# EAGLE board esp32-kitchensink (EAGLE 9.6.2)
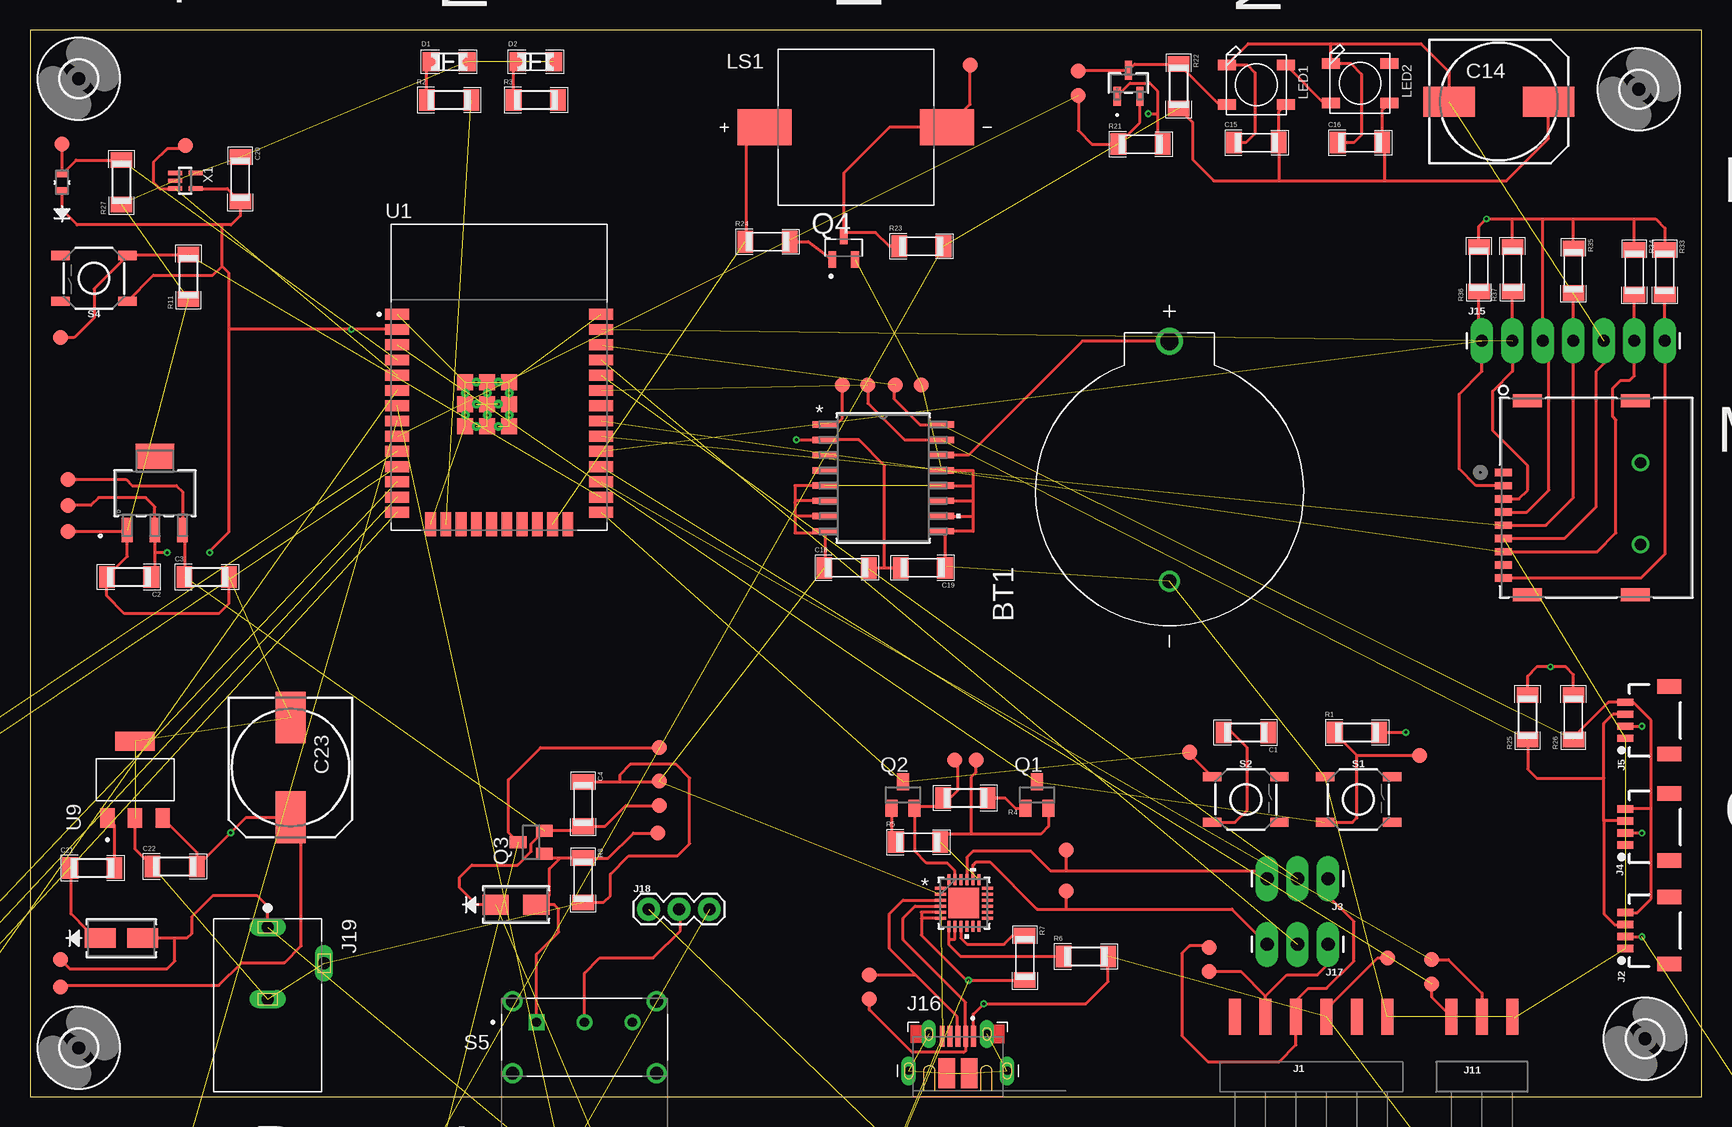
[diagram p8: board, top side]
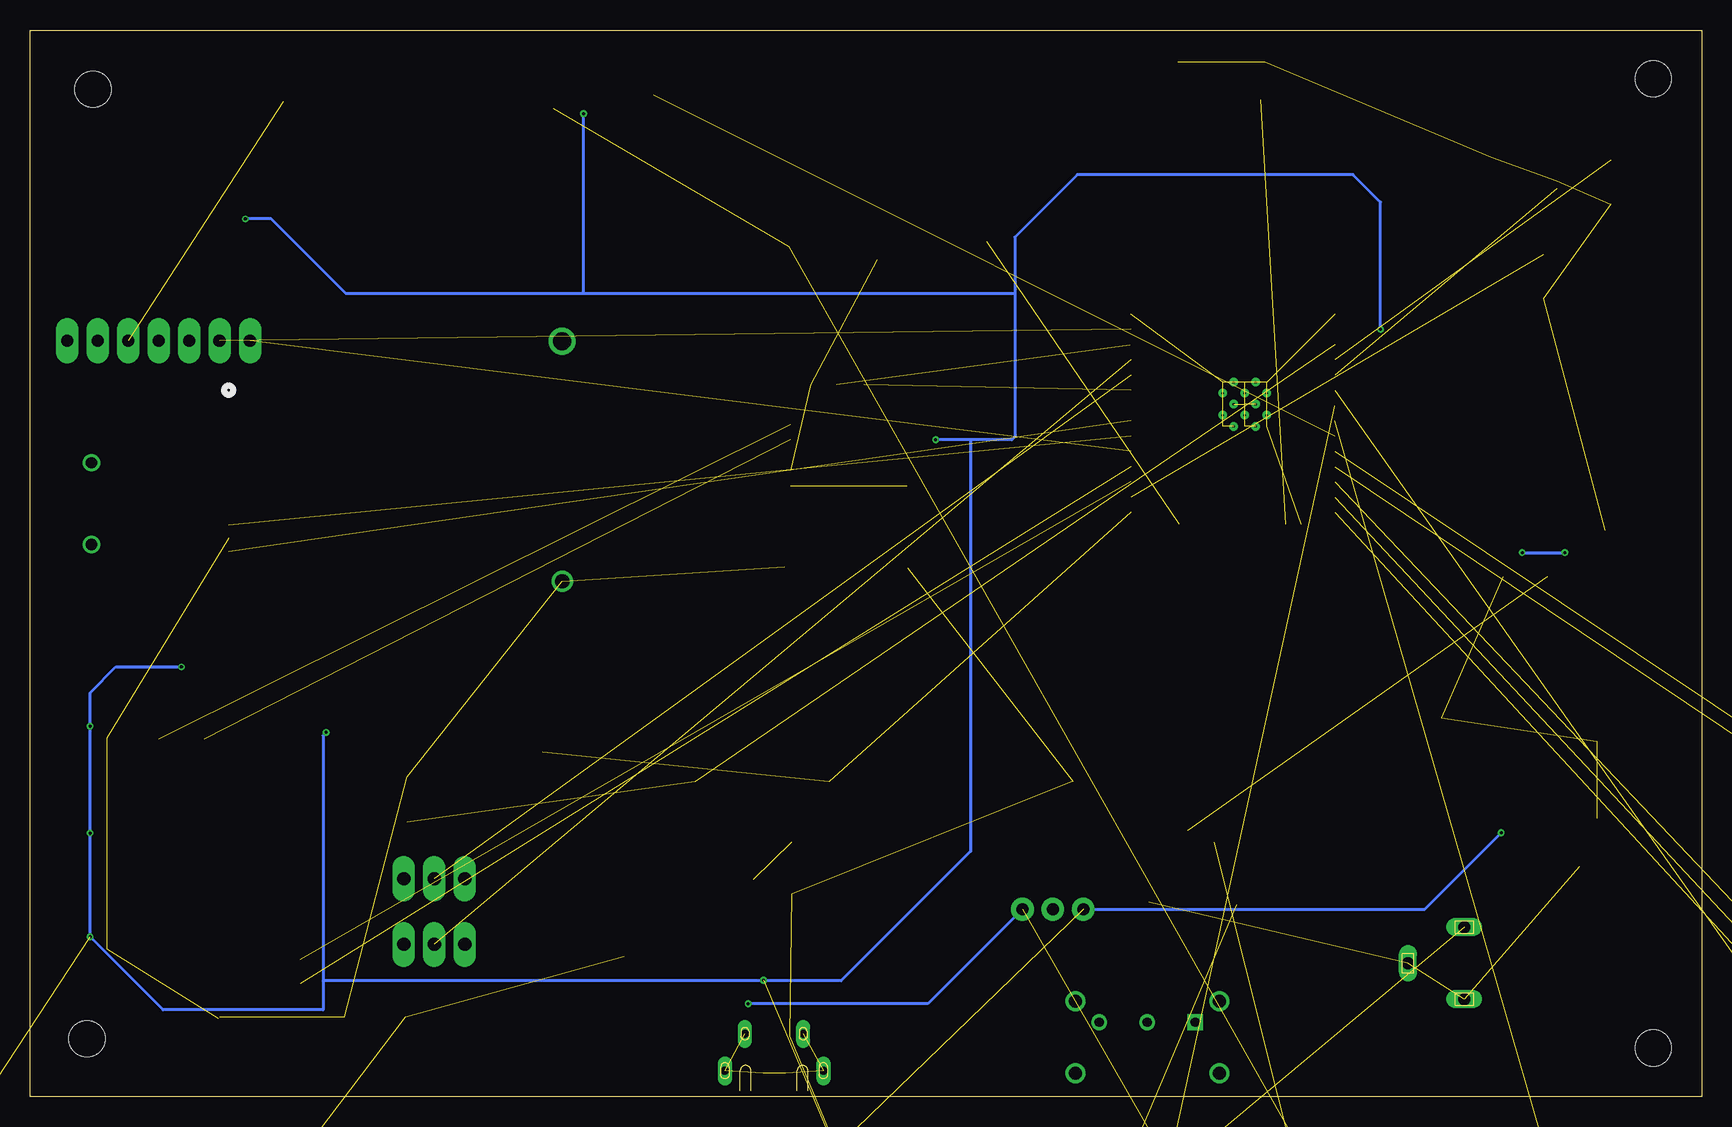
[diagram p9: board, bottom side, seen from below]

Size 139.37 x 88.89 mm. Coordinates in mm from the lower left corner, seen from the top.
Outline: 0,0 139.37,0 139.37,88.89 0,88.89 0,0
Copper layers (1*16): Top 0.035mm / dielectric 1.5mm / Bottom 0.035mm
Design rules "design_rule_check": minimum track width 6mil, minimum drill 10mil, track to track 6mil, track to pad 6mil, pad to pad 6mil, via to via 6mil, smd to smd 6mil, copper to edge 20mil, drill to drill 10mil, minimum pad ring 10mil, minimum via ring 6mil, stop-mask expansion 4mil, vias tented up to drill 0mil, thermal gap 10mil

## Footprints (pad centres in the part's own frame; a part is rotated, then mirrored left to right if it is on the bottom)
BAT_BS-7 = drill 1.5: + 10,0 | drill 1.17: - -10,0
1206 = smd 1.3 x 1.8: 1 -1.85,0; 2 1.85,0
140CLH-1010 = smd 4.3 x 2.5: + 4.15,0; - -4.15,0
JST-PH-2-THM-RA = drill 0.8 pad 1.422: 1 1,0; 2 -1,0
1206.LED = smd 1.4 x 1.6: P$1 -1.5,0; P$2 1.5,0
DIODE_DO214AC = smd 2.184 x 1.651: 1 -1.702,0; 2 1.702,0
SMA_DIO-M = smd 2.561 x 1.63: 1 -1.768,0; 2 1.768,0
3,0 = hole 3: 0,0
1X06-SMD_RA_MALE_NO_HOLES = smd 1 x 3: 1 -6.35,5; 2 -3.81,5; 3 -1.27,5; 4 1.27,5; 5 3.81,5; 6 6.35,5
1X04_1MM_RA = smd 0.6 x 1.35: 1 -1.5,0; 2 -0.5,0; 3 0.5,0; 4 1.5,0 | smd 1.2 x 2: NC1 2.8,-3.675; NC2 -2.8,-3.675
1X03_LONGPADS = drill 1.118 pad 1.88 long: 1 0,0; 2 2.54,0; 3 5.08,0
1X02_2.54_SCREWTERM = drill 1.016 square: P1 2.54,0; P2 0,0
1X02 = drill 1.016 pad 1.88: 1 0,0; 2 2.54,0
1X03 = drill 1.016 pad 1.88: 1 0,0; 2 2.54,0; 3 5.08,0
SCREWTERMINAL-5MM-2 = drill 1.3 pad 2.032 square: 1 0,0 | drill 1.3 pad 2.032: 2 5,0
1X03_SMD_RA_MALE = smd 1 x 3: 1 -2.54,5; 2 0,5; 3 2.54,5
1X02_LOCK_LONGPADS = drill 1.016 long: 1 -0.127,0; 2 2.667,0
MEM2075-00-140-01-A_GCT = smd 1.092 x 2.388: 10 -8.075,5.745; 11 8.075,5.745; 12 -8.075,-3.255; 13 8.075,-3.255 | drill 0.94 pad 1.448: 14 -3.886,-3.683; 15 2.921,-3.683 | smd 0.61 x 1.397: P1 2.105,7.745; P2 1.005,7.745; P3 -0.095,7.745; P4 -1.195,7.745; P5 -2.295,7.745; P6 -3.395,7.745; P7 -4.495,7.745; P8 -5.595,7.745; P9 -6.695,7.745
1X07_LONGPADS = drill 1.016 pad 1.88 long: 1 0,0; 2 2.54,0; 3 5.08,0; 4 7.62,0; 5 10.16,0; 6 12.7,0; 7 15.24,0
AMPHENOL_10103592-0001LF = smd 0.4 x 1.75: 1 1.3,2.875; 2 0.65,2.875; 3 0,2.875; 4 -0.65,2.875; 5 -1.3,2.875 | drill 0.65 pad 0.8 long: P1 -2.425,3.08; P2 2.425,3.08 | drill 0.7 pad 1.05 long: P3 -4.1,0; P6 4.1,0 | smd 1.375 x 2.5: P4 -0.938,-0.2; P5 0.938,-0.2
CUI_PJ-102AH = drill 1 long: 1 -6.5,0; 2 -0.5,0; 3 -3.5,4.7
IND_TAIYO_NRH2410_TAY = smd 0.699 x 2.007: 1 -0.73,0; 2 0.73,0
IND_NRS5024_TAY = smd 1.499 x 3.988: 1 -1.8,0; 2 1.8,0
WS2812B = smd 1.5 x 0.9: 1-VDD 2.45,-1.65; 2-DOUT 2.45,1.65; 3-GND -2.45,1.65; 4-DIN -2.45,-1.65
LED_77/TR8_EVE = smd 0.552 x 0.889: 1 -0.676,0; 2 0.676,0
XDCR_SMT-1341-T-HT-R = smd 4.5 x 3: N 7.6,0; P -7.6,0
SOT23 = smd 1 x 1.4: 1 -0.95,-1.1; 2 0.95,-1.1; 3 0,1.1
PN2222A-SOT-23 = smd 0.635 x 1.397: BASE -0.95,-0.98; COLLECTOR 0,0.98; EMITTER 0.95,-0.98
SOIC127P600X175-8N = smd 1.525 x 0.7: 1 -2.712,1.905; 2 -2.712,0.635; 3 -2.712,-0.635; 4 -2.712,-1.905; 5 2.712,-1.905; 6 2.712,-0.635; 7 2.712,0.635; 8 2.712,1.905
RESC6331X80N = smd 2.44 x 3.32: 1 -2.39,0; 2 2.39,0
TACTILE_SWITCH_SMD_5.2MM = smd 1.524 x 0.762: 1 -2.794,1.905; 2 2.794,1.905; 3 -2.794,-1.905; 4 2.794,-1.905
SW_EG1224 = drill 0.79 square: 1 -4,1.25 | drill 0.79: 2 0,1.25; 3 4,1.25 | drill 1.09: S1 -6,-3; S2 6,-3; S3 6,3; S4 -6,3
TP = smd 3.81 x 5.08: P$1 0,0
PAD.03X.05 = smd 1.27 x 1.27: P$1 0,0
MODULE_ESP32-WROOM-32D = smd 2 x 0.9: 1 -8.5,5.26; 2 -8.5,3.99; 3 -8.5,2.72; 4 -8.5,1.45; 5 -8.5,0.18; 6 -8.5,-1.09; 7 -8.5,-2.36; 8 -8.5,-3.63; 9 -8.5,-4.9; 10 -8.5,-6.17; 11 -8.5,-7.44; 12 -8.5,-8.71; 13 -8.5,-9.98; 14 -8.5,-11.25; 25 8.5,-11.25; 26 8.5,-9.98; 27 8.5,-8.71; 28 8.5,-7.44; 29 8.5,-6.17; 30 8.5,-4.9; 31 8.5,-3.63; 32 8.5,-2.36; 33 8.5,-1.09; 34 8.5,0.18; 35 8.5,1.45; 36 8.5,2.72; 37 8.5,3.99; 38 8.5,5.26 | smd 0.9 x 2: 15 -5.715,-12.25; 16 -4.445,-12.25; 17 -3.175,-12.25; 18 -1.905,-12.25; 19 -0.635,-12.25; 20 0.635,-12.25; 21 1.905,-12.25; 22 3.175,-12.25; 23 4.445,-12.25; 24 5.715,-12.25 | smd 1.33 x 1.33: 39_1 -2.835,-0.405; 39_2 -1,-0.405; 39_3 0.835,-0.405; 39_4 -2.835,-2.24; 39_5 -1,-2.24; 39_6 0.835,-2.24; 39_7 -2.835,-4.075; 39_8 -1,-4.075; 39_9 0.835,-4.075 | drill 0.2 pad 0.3: 39_10 -1.917,-0.405; 39_11 -0.083,-0.405; 39_12 -2.835,-1.323; 39_13 -1,-1.323; 39_14 0.835,-1.323; 39_15 -1.917,-2.24; 39_16 -0.083,-2.24; 39_17 -2.835,-3.158; 39_18 -1,-3.158; 39_19 0.835,-3.158; 39_20 -1.917,-4.075; 39_21 -0.083,-4.075
SOT-223_DIO-M = smd 0.902 x 2.066: 1 -2.3,-3.076; 2 0,-3.076; 3 2.3,-3.076 | smd 3.202 x 2.066: 4 0,3.076
QFN24_CP2102N_SIL-M = smd 0.914 x 0.254: 1 -1.943,1.25; 2 -1.943,0.75; 3 -1.943,0.25; 4 -1.943,-0.25; 5 -1.943,-0.75; 6 -1.943,-1.25; 13 1.943,-1.25; 14 1.943,-0.75; 15 1.943,-0.25; 16 1.943,0.25; 17 1.943,0.75; 18 1.943,1.25 | smd 0.254 x 0.914: 7 -1.25,-1.943; 8 -0.75,-1.943; 9 -0.25,-1.943; 10 0.25,-1.943; 11 0.75,-1.943; 12 1.25,-1.943; 19 1.25,1.943; 20 0.75,1.943; 21 0.25,1.943; 22 -0.25,1.943; 23 -0.75,1.943; 24 -1.25,1.943 | smd 2.54 x 2.54: 25 0,0
SOT-23-5_MC_MCH-M = smd 1.626 x 0.508: 1 -1.346,0.95; 2 -1.346,0; 3 -1.346,-0.95; 4 1.346,-0.95; 5 1.346,0.95
DBV0005A_M = smd 1.2 x 0.65: 1 -1.475,0.95; 2 -1.475,0; 3 -1.475,-0.95; 4 1.475,-0.95; 5 1.475,0.95
MSOP8_DIO = smd 1.041 x 0.381: 1 -2.121,0.975; 2 -2.121,0.325; 3 -2.121,-0.325; 4 -2.121,-0.975; 5 2.121,-0.975; 6 2.121,-0.325; 7 2.121,0.325; 8 2.121,0.975
SOIC8_ZXBM5210-SP-13_DIO-M = smd 1.653 x 0.559: 1 -2.782,1.905; 2 -2.782,0.635; 3 -2.782,-0.635; 4 -2.782,-1.905; 5 2.782,-1.905; 6 2.782,-0.635; 7 2.782,0.635; 8 2.782,1.905
SOT-23_3L_ONS-M = smd 0.61 x 1.575: 1 -0.953,-1.092; 2 0.953,-1.092; 3 0,1.092
VREG_TS2940CW50_RPG = smd 1.6 x 1.2: 1 -3.2,2.3; 2 -3.2,0; 3 -3.2,-2.3 | smd 1.6 x 3.3: 4 3.2,0
SC59_DIO-M = smd 0.482 x 1.416: 1 -1.2,-1.251; 2 0,1.251; 3 1.2,-1.251
21-0042B_16_MXM-M = smd 2.083 x 0.533: 1 -4.839,4.445; 2 -4.839,3.175; 3 -4.839,1.905; 4 -4.839,0.635; 5 -4.839,-0.635; 6 -4.839,-1.905; 7 -4.839,-3.175; 8 -4.839,-4.445; 9 4.839,-4.445; 10 4.839,-3.175; 11 4.839,-1.905; 12 4.839,-0.635; 13 4.839,0.635; 14 4.839,1.905; 15 4.839,3.175; 16 4.839,4.445
SOIC-16_ONS-M = smd 1.702 x 0.533: 1 -2.807,4.445; 2 -2.807,3.175; 3 -2.807,1.905; 4 -2.807,0.635; 5 -2.807,-0.635; 6 -2.807,-1.905; 7 -2.807,-3.175; 8 -2.807,-4.445; 9 2.807,-4.445; 10 2.807,-3.175; 11 2.807,-1.905; 12 2.807,-0.635; 13 2.807,0.635; 14 2.807,1.905; 15 2.807,3.175; 16 2.807,4.445
SC70-5 = smd 0.35 x 1.15: 1 -0.65,-0.85; 2 0,-0.85; 3 0.65,-0.85; 4 0.65,0.85; 5 -0.65,0.85

## Placement (x,y rotation side)
BT1  BS-7  [BAT_BS-7]  95,52.96 90 top
C1  0.1 uF  [1206]  101.35,30.35 180 top
C2  1 uF  [1206]  8.26,43.31 180 top
C3  1 uF  [1206]  14.73,43.31 0 top
C4  1.0 uF  [1206]  46.1,24.38 270 top
C5  4.7 uF  [1206]  -36.83,-121.92 0 top  (outside the outline)
C6  4.7 uF  [1206]  -30.48,-121.92 0 top  (outside the outline)
C7  22 uF  [1206]  119.38,-128.27 0 top  (outside the outline)
C8  120 pF  [1206]  125.73,-128.27 0 top  (outside the outline)
C9  10 uF  [1206]  2.54,-119.38 0 top  (outside the outline)
C10  22 uF  [1206]  8.89,-119.38 0 top  (outside the outline)
C11  22 uF  [1206]  15.24,-119.38 0 top  (outside the outline)
C12  1 uF  [1206]  -154.94,-54.61 0 top  (outside the outline)
C13  10 uF  [1206]  -148.59,-54.61 0 top  (outside the outline)
C14  1000 uF  [140CLH-1010]  122.43,82.93 0 top
C15  0.1 uF  [1206]  102.23,79.5 0 top
C16  0.1 uF  [1206]  110.87,79.5 0 top
C17  0.1 uF  [1206]  49.53,-55.88 0 top  (outside the outline)
C18  0.1 uF  [1206]  68.07,44.07 0 top
C19  10 uF  [1206]  74.42,44.07 180 top
C20  1 uF  [1206]  17.53,76.45 270 top
C21  0.47 uF  [1206]  5.21,19.05 0 top
C22  22 uF  [1206]  12.06,19.18 0 top
C23  1000 uF  [140CLH-1010]  21.72,27.43 270 top
CN2  [JST-PH-2-THM-RA]  -43.18,-120.65 0 top  (outside the outline)
D1  [1206.LED]  34.92,86.23 0 top
D2  [1206.LED]  42.16,86.23 0 top
D3  [1206.LED]  -44.45,-113.03 0 top  (outside the outline)
D4  SS14-E3/5AT  [DIODE_DO214AC]  40.51,16 0 top
D5  SS14-E3/5AT  [DIODE_DO214AC]  102.87,-133.35 0 top  (outside the outline)
D6  [1206.LED]  -76.2,-57.15 0 top  (outside the outline)
D7  [1206.LED]  -69.85,-57.15 0 top  (outside the outline)
D8  [1206.LED]  -63.5,-57.15 0 top  (outside the outline)
D9  [1206.LED]  -57.15,-57.15 0 top  (outside the outline)
D10  [1206.LED]  -90.17,-52.07 0 top  (outside the outline)
D11  [1206.LED]  -83.82,-52.07 0 top  (outside the outline)
D12  [1206.LED]  -77.47,-52.07 0 top  (outside the outline)
D13  [1206.LED]  -71.12,-52.07 0 top  (outside the outline)
D14  RS1BB-13-FSMA_DIO-M  [SMA_DIO-M]  7.62,13.21 0 top
H1  MOUNT-HOLE3.0  [3,0]  134.11,83.95 0 top
H2  MOUNT-HOLE3.0  [3,0]  134.62,4.83 0 top
H3  MOUNT-HOLE3.0  [3,0]  4.06,84.84 0 top
H4  MOUNT-HOLE3.0  [3,0]  4.06,4.06 0 top
J1  [1X06-SMD_RA_MALE_NO_HOLES]  106.81,1.65 0 top
J2  [1X04_1MM_RA]  132.97,13.84 90 top
J3  [1X03_LONGPADS]  108.2,18.16 180 top
J4  [1X04_1MM_RA]  132.97,22.48 90 top
J5  [1X04_1MM_RA]  132.97,31.37 90 top
J6  [1X02_2.54_SCREWTERM]  -162.56,-53.34 0 top  (outside the outline)
J7  [1X02]  -143.51,-54.61 0 top  (outside the outline)
J8  [1X03]  60.96,-113.03 0 top  (outside the outline)
J9  [SCREWTERMINAL-5MM-2]  -8.89,-80.01 0 top  (outside the outline)
J10  [SCREWTERMINAL-5MM-2]  -8.89,-71.12 0 top  (outside the outline)
J11  [1X03_SMD_RA_MALE]  121.03,1.65 0 top
J12  [1X03_LONGPADS]  -95.25,-115.57 0 top  (outside the outline)
J13  [1X02_LOCK_LONGPADS]  -149.86,-133.35 0 top  (outside the outline)
J14  MEM2075-00-140-01-A  [MEM2075-00-140-01-A_GCT]  130.56,49.91 90 top
J15  [1X07_LONGPADS]  121.03,62.99 0 top
J16  10103592-0001LF-EK  [AMPHENOL_10103592-0001LF]  77.34,2.16 0 top
J17  [1X03_LONGPADS]  108.2,12.7 180 top
J18  [1X03]  51.56,15.62 0 top
J19  PJ-102AH  [CUI_PJ-102AH]  19.81,7.62 270 top
L1  2.2 uH 970 mA NRH2410T2R2MN  [IND_TAIYO_NRH2410_TAY]  102.87,-127 0 top  (outside the outline)
L2  NRS5024T2R2NMGJ  [IND_NRS5024_TAY]  15.24,-127 0 top  (outside the outline)
LED1  WS2812B5050  [WS2812B]  102.23,84.33 0 top
LED2  WS2812B5050  [WS2812B]  110.87,84.45 0 top
LED3  ALS-PT19-315C/L177/TR8  [LED_77/TR8_EVE]  2.67,76.2 90 top
LS1  SMT-1341-T-HT-R  [XDCR_SMT-1341-T-HT-R]  68.83,80.77 0 top
Q1  MMBT3904_R1  [SOT23]  83.95,25.15 0 top
Q2  MMBT3904_R1  [SOT23]  72.77,25.15 0 top
Q3  AO3401  [SOT23]  41.78,21.21 90 top
Q4  PN2222A-SOT-23  [PN2222A-SOT-23]  67.82,70.74 0 top
Q5  IRF7341TRPBF  [SOIC127P600X175-8N]  -5.08,-63.5 0 top  (outside the outline)
R1  10K  [1206]  110.62,30.35 0 top
R2  1K  [1206]  34.92,83.06 0 top
R3  1K  [1206]  42.16,83.06 0 top
R4  10K  [1206]  77.98,24.89 180 top
R5  10K  [1206]  74.04,21.21 0 top
R6  10  [1206]  88.01,11.68 0 top
R7  1K  [1206]  82.93,11.56 270 top
R8  10K  [1206]  46.1,18.03 270 top
R9  1K  [1206]  -24.13,-121.92 0 top  (outside the outline)
R10  2K  [1206]  -17.78,-121.92 0 top  (outside the outline)
R11  10k  [1206]  13.21,68.33 90 top
R12  10k  [1206]  -142.24,-132.08 0 top  (outside the outline)
R13  220  [1206]  -148.59,-127 0 top  (outside the outline)
R14  2.2k  [1206]  -142.24,-127 0 top  (outside the outline)
R15  3.3k  [1206]  -148.59,-121.92 0 top  (outside the outline)
R16  5  [1206]  90.17,-113.03 0 top  (outside the outline)
R17  10k  [1206]  -142.24,-121.92 0 top  (outside the outline)
R18  100K  [1206]  21.59,-119.38 0 top  (outside the outline)
R19  750K  [1206]  27.94,-119.38 0 top  (outside the outline)
R20  100K  [1206]  2.54,-114.3 0 top  (outside the outline)
R21  10k  [1206]  92.58,79.38 0 top
R22  10k  [1206]  95.76,84.2 270 top
R23  330  [1206]  74.3,70.87 0 top
R24  2K  [1206]  61.47,71.25 0 top
R25  4.7k  [1206]  124.84,31.62 90 top
R26  4.7k  [1206]  128.65,31.62 90 top
R27  10k  [1206]  7.62,76.2 90 top
R28  10k  [1206]  55.88,-55.88 0 top  (outside the outline)
R29  3.3, 2W  [RESC6331X80N]  -7.62,-57.15 0 top  (outside the outline)
R30  3.3, 2W  [RESC6331X80N]  1.27,-57.15 0 top  (outside the outline)
R31  10k  [1206]  -8.89,-52.07 0 top  (outside the outline)
R32  10k  [1206]  -2.54,-52.07 0 top  (outside the outline)
R33  47k  [1206]  136.27,68.71 270 top
R34  47k  [1206]  133.73,68.71 270 top
R35  47k  [1206]  128.65,68.83 270 top
R36  47k  [1206]  120.78,68.96 90 top
R37  47k  [1206]  123.57,68.96 90 top
R38  330  [1206]  -88.9,-60.96 0 top  (outside the outline)
R39  330  [1206]  -82.55,-60.96 0 top  (outside the outline)
R40  330  [1206]  -76.2,-60.96 0 top  (outside the outline)
R41  330  [1206]  -69.85,-60.96 0 top  (outside the outline)
R42  330  [1206]  -63.5,-60.96 0 top  (outside the outline)
R43  330  [1206]  -57.15,-60.96 0 top  (outside the outline)
R44  330  [1206]  -88.9,-55.88 0 top  (outside the outline)
R45  330  [1206]  -82.55,-55.88 0 top  (outside the outline)
S1  MOMENTARY-SWITCH-SPST-SMD-5.2MM  [TACTILE_SWITCH_SMD_5.2MM]  110.74,24.77 0 top
S2  MOMENTARY-SWITCH-SPST-SMD-5.2MM  [TACTILE_SWITCH_SMD_5.2MM]  101.35,24.77 0 top
S4  MOMENTARY-SWITCH-SPST-SMD-5.2MM  [TACTILE_SWITCH_SMD_5.2MM]  5.33,68.2 180 top
S5  EG1224  [SW_EG1224]  46.23,4.95 0 top
TP1  TP  [TP]  213.36,-132.08 0 top  (outside the outline)
TP2  TP  [TP]  224.79,-132.08 0 top  (outside the outline)
TP3  TP  [TP]  213.36,-124.46 0 top  (outside the outline)
TP4  TP  [TP]  224.79,-124.46 0 top  (outside the outline)
TP5  TP  [TP]  213.36,-116.84 0 top  (outside the outline)
TP6  TP  [TP]  224.79,-116.84 0 top  (outside the outline)
TP7  TP  [TP]  167.64,-134.62 0 top  (outside the outline)
TP8  TP  [TP]  167.64,-127 0 top  (outside the outline)
TP9  TP  [TP]  167.64,-119.38 0 top  (outside the outline)
TP10  TP  [TP]  167.64,-149.86 0 top  (outside the outline)
TP11  TP  [TP]  167.64,-142.24 0 top  (outside the outline)
TP12  TEST-POINT3X5  [PAD.03X.05]  113.16,11.56 0 top
TP13  TEST-POINT3X5  [PAD.03X.05]  98.3,12.45 0 top
TP14  TEST-POINT3X5  [PAD.03X.05]  98.3,10.41 0 top
TP15  TEST-POINT3X5  [PAD.03X.05]  116.84,9.4 0 top
TP16  TEST-POINT3X5  [PAD.03X.05]  116.84,11.43 0 top
TP17  TEST-POINT3X5  [PAD.03X.05]  69.98,8.13 90 top
TP18  TEST-POINT3X5  [PAD.03X.05]  69.98,10.16 90 top
TP19  TEST-POINT3X5  [PAD.03X.05]  86.36,20.57 90 top
TP20  TEST-POINT3X5  [PAD.03X.05]  86.36,17.14 90 top
TP21  TEST-POINT3X5  [PAD.03X.05]  52.32,21.97 90 top
TP22  TEST-POINT3X5  [PAD.03X.05]  52.45,29.08 90 top
TP23  TEST-POINT3X5  [PAD.03X.05]  52.45,24.26 90 top
TP24  TEST-POINT3X5  [PAD.03X.05]  -40.64,-113.03 0 top  (outside the outline)
TP25  TEST-POINT3X5  [PAD.03X.05]  -38.1,-113.03 0 top  (outside the outline)
TP26  TEST-POINT3X5  [PAD.03X.05]  3.17,51.44 0 top
TP27  TEST-POINT3X5  [PAD.03X.05]  3.17,49.28 0 top
TP28  TEST-POINT3X5  [PAD.03X.05]  6.35,-115.57 0 top  (outside the outline)
TP29  TEST-POINT3X5  [PAD.03X.05]  8.89,-115.57 0 top  (outside the outline)
TP30  TEST-POINT3X5  [PAD.03X.05]  93.98,-114.3 0 top  (outside the outline)
TP31  TEST-POINT3X5  [PAD.03X.05]  96.52,-114.3 0 top  (outside the outline)
TP32  TEST-POINT3X5  [PAD.03X.05]  99.06,-114.3 0 top  (outside the outline)
TP33  TEST-POINT3X5  [PAD.03X.05]  11.43,-115.57 0 top  (outside the outline)
TP34  TEST-POINT3X5  [PAD.03X.05]  -35.56,-113.03 0 top  (outside the outline)
TP35  TEST-POINT3X5  [PAD.03X.05]  3.17,47.12 0 top
TP36  TEST-POINT3X5  [PAD.03X.05]  52.45,26.29 90 top
TP37  TEST-POINT3X5  [PAD.03X.05]  -151.13,-118.11 0 top  (outside the outline)
TP38  TEST-POINT3X5  [PAD.03X.05]  -148.59,-118.11 0 top  (outside the outline)
TP39  TEST-POINT3X5  [PAD.03X.05]  12.95,79.25 0 top
TP40  TEST-POINT3X5  [PAD.03X.05]  2.67,79.38 0 top
TP41  TEST-POINT3X5  [PAD.03X.05]  2.54,63.25 0 top
TP42  TEST-POINT3X5  [PAD.03X.05]  78.36,85.98 0 top
TP43  TEST-POINT3X5  [PAD.03X.05]  59.69,-55.88 0 top  (outside the outline)
TP44  TEST-POINT3X5  [PAD.03X.05]  87.38,83.44 0 top
TP45  TEST-POINT3X5  [PAD.03X.05]  -138.43,-55.88 0 top  (outside the outline)
TP46  TEST-POINT3X5  [PAD.03X.05]  -135.89,-55.88 0 top  (outside the outline)
TP47  TEST-POINT3X5  [PAD.03X.05]  -133.35,-55.88 0 top  (outside the outline)
TP48  TEST-POINT3X5  [PAD.03X.05]  -130.81,-55.88 0 top  (outside the outline)
TP49  TEST-POINT3X5  [PAD.03X.05]  87.38,85.47 0 top
TP50  TEST-POINT3X5  [PAD.03X.05]  -67.31,-52.07 0 top  (outside the outline)
TP51  TEST-POINT3X5  [PAD.03X.05]  -64.77,-52.07 0 top  (outside the outline)
TP52  TEST-POINT3X5  [PAD.03X.05]  -62.23,-52.07 0 top  (outside the outline)
TP53  TEST-POINT3X5  [PAD.03X.05]  -59.69,-52.07 0 top  (outside the outline)
TP54  TEST-POINT3X5  [PAD.03X.05]  67.69,59.31 0 top
TP55  TEST-POINT3X5  [PAD.03X.05]  1.27,-53.34 0 top  (outside the outline)
TP56  TEST-POINT3X5  [PAD.03X.05]  3.81,-53.34 0 top  (outside the outline)
TP57  TEST-POINT3X5  [PAD.03X.05]  72.14,59.31 0 top
TP58  TEST-POINT3X5  [PAD.03X.05]  69.85,59.31 0 top
TP59  TEST-POINT3X5  [PAD.03X.05]  74.3,59.31 0 top
TP60  TEST-POINT3X5  [PAD.03X.05]  115.82,28.45 0 top
TP61  TEST-POINT3X5  [PAD.03X.05]  96.65,28.7 0 top
TP62  TEST-POINT3X5  [PAD.03X.05]  77.09,28.07 90 top
TP63  TEST-POINT3X5  [PAD.03X.05]  78.87,28.07 90 top
TP64  TP  [TP]  213.36,-140.46 0 top  (outside the outline)
TP65  TP  [TP]  213.36,-147.45 0 top  (outside the outline)
TP66  TEST-POINT3X5  [PAD.03X.05]  2.54,11.43 0 top
TP67  TEST-POINT3X5  [PAD.03X.05]  2.54,9.14 0 top
U1  ESP32-WROOM-32D  [MODULE_ESP32-WROOM-32D]  39.12,59.94 0 top
U2  AP2111H-3.3TRG1SOT-223_DIO-M  [SOT-223_DIO-M]  10.41,50.29 0 top
U3  CP2102N-A02-GQFN24QFN24_CP2102N_SIL-M  [QFN24_CP2102N_SIL-M]  77.85,16.13 0 top
U4  MCP73831T-3ACI/OTSOT-23-5_MC_MCH-M  [SOT-23-5_MC_MCH-M]  -30.48,-132.08 0 top  (outside the outline)
U5  TPS613222ADBVTDBV0005A_M  [DBV0005A_M]  90.17,-120.65 0 top  (outside the outline)
U6  PAM2401SCADJ  [MSOP8_DIO]  15.24,-134.62 0 top  (outside the outline)
U7  ZXBM5210-SP-13SOIC8_ZXBM5210-SP-13_DIO-M  [SOIC8_ZXBM5210-SP-13_DIO-M]  -147.32,-64.77 0 top  (outside the outline)
U8  BSS138SOT-23_3L_ONS-M  [SOT-23_3L_ONS-M]  91.57,84.45 0 top
U9  TS2940CW50_RPG  [VREG_TS2940CW50_RPG]  8.76,26.42 90 top
U10  AH1807-W-7SC59_DIO-M  [SC59_DIO-M]  53.34,-50.8 0 top  (outside the outline)
U11  DS3231M+TRL21-0042B_16_MXM-M  [21-0042B_16_MXM-M]  71.12,51.56 0 top
U12  MC74HC595ADR2GSOIC-16_ONS-M  [SOIC-16_ONS-M]  -76.2,-73.66 0 top  (outside the outline)
X1  TMP235_DCKR  [SC70-5]  12.95,76.33 270 top

## Tracks (layer width: path | path; a pad name or v marks a point on that pad's centre or on a via)
1S_LIPO  (3 unrouted)
4S_LIPO  (3 unrouted)
5V  (7 unrouted)
  Top 0.254: LED1.1-VDD 104.08,82.08 C15.2 104.08,76.38 104.14,76.33 | LED2.1-VDD 112.72,82.2 C16.2 112.9,79.32 112.9,76.33 | R22.2 96.9,81.21 96.9,78.11 98.68,76.33 104.14,76.33 | C14.+ 126.58,79.84 123.06,76.33 112.9,76.33 | 104.14,76.33 112.9,76.33
5V_A  (6 unrouted)
5V_B  (6 unrouted)
5V_DC_IN  (via drill 0.25)  (1 unrouted)
  Top 0.254: U9.3 13.91,20.36 C22.2 v16.74,22 18.02,23.28 C23.+ 22.61,22.39 22.61,12.57 21.21,11.18 17.65,11.18 15.75,9.27 2.67,9.27 TP67.P$1
  Bottom 0.254: J18.1 23.11,15.62 v16.74,22
BATT_LEVEL  (1 unrouted)
BUZZER  (1 unrouted)
  Top 0.254: LS1.P 59.69,79.23 59.69,71.32 R24.1
CP_RX
  Top 0.254: U3.20 78.6,19.29 78.87,19.56 80.01,19.56 83.95,15.62 86.36,15.62 | J17.3 100.2,15.62 86.36,15.62 | TP20.P$1 86.36,15.62
CP_TX
  Top 0.254: U3.21 78.1,19.93 78.61,20.45 83.44,20.45 85.09,18.8 86.36,18.8 | J3.3 103.12,18.54 102.87,18.8 86.36,18.8 | TP19.P$1 86.36,18.8
DC_JACK  (1 unrouted)
  Top 0.254: J19.1 19.81,15.88 18.92,16.76 15.24,16.76 13.46,14.99 13.46,13.59 13.08,13.21 12.06,13.21 | 12.06,13.21 D14.2 | TP66.P$1 3.3,10.67 11.43,10.67 12.06,11.3 12.06,13.21
DTR
  Top 0.254: U3.23 77.1,18.83 76.47,19.47 74.74,19.47 73.72,20.49 Q2.2 73.85,24.17 75.41,24.17 R4.2 76.25,25.02 76.83,25.02 77.34,25.53 77.34,27.81 TP62.P$1
EN  (2 unrouted)
  Top 0.254: S1.3 110.24,22.86 110.62,23.24 110.62,28.45 | R1.1 108.77,30.3 110.62,28.45 | 110.62,28.45 TP60.P$1
FTDI_RX
  Top 0.254: 103,8.38 104.78,10.16 107.31,10.16 108.2,11.05 J17.1 | J1.2 103,8.38 | TP14.P$1 100.97,10.41 103,8.38
FTDI_TX
  Top 0.254: J3.1 108.2,16.76 110.36,14.61 110.36,11.3 108.08,9.02 106.55,9.02 105.54,8 J1.3 105.54,4.32 104.14,2.92 98.17,2.92 96.01,5.08 96.01,11.94 96.65,12.57 98.17,12.57 TP13.P$1
GND  (70 unrouted)
  Top 0.254: C4.1 49.15,26.23 | 49.15,26.23 52.4,26.23 TP36.P$1 | C22.1 8.76,20.63 U9.2 | R8.2 47.81,16.18 48.39,16.76 48.39,18.54 49.91,20.07 53.98,20.07 54.99,21.08 54.99,26.54 53.85,27.69 50.04,27.69 49.15,26.8 49.15,26.23 | TP35.P$1 8.02,47.12 U2.1 8.11,45.02 C2.2 6.41,41.73 7.87,40.26 15.75,40.26 16.58,41.09 C3.2 | U11.5 63.75,50.93 63.75,49.53 | 63.75,49.53 63.75,48.39 | 63.75,48.39 63.75,46.99 66.15,46.99 U11.8 66.28,44.13 C18.1 | U11.7 63.75,48.39 | U11.6 63.88,49.66 63.75,49.53 | U11.13 78.61,52.2 78.61,50.93 | 78.61,50.93 78.61,49.66 | 78.61,49.66 78.61,48.39 | 78.61,48.39 78.61,47.12 U11.9 76.27,46.8 76.27,44.32 | U11.10 78.61,48.39 | U11.11 78.61,49.66 | U11.12 78.61,50.93 | 76.27,44.32 C19.1 | 76.45,44.14 76.27,44.32 | C15.1 101.35,79.5 102.11,80.26 102.11,85.34 101.47,85.98 LED1.3-GND 101.55,87.75 108.46,87.75 | C16.1 110.36,79.5 111,80.14 111,85.22 110.11,86.11 LED2.3-GND 108.46,86.14 108.46,87.75 | 108.46,87.75 115.95,87.75 118.28,85.42 C14.- | 123.7,6.52 J11.3 | J14.P6 127.92,46.52 130.56,49.15 130.56,60.45 131.19,61.09 J15.5
HALL_SENS  (3 unrouted)
HB_LED  (5 unrouted)
I2C_SCL  (2 unrouted)
  Top 0.254: TP57.P$1 72.01,59.31 72.01,58.17 74.17,56.01 U11.16 | 47.67,62.61 U1.36 | J2.4 133.96,15.34 135.13,16.51 135.13,24 | 135.13,24 132.99,24 J4.4 | 135.13,24 135.13,31.37 133.6,32.89 132.99,32.89 J5.4 131.57,32.87 128.65,29.95 R26.1
I2C_SDA  (2 unrouted)
  Top 0.254: TP58.P$1 69.85,57.78 72.9,54.74 U11.15 | J5.3 131.94,31.87 131.19,31.11 131.19,26.54 | 131.19,22.99 131.2,22.98 | J4.3 131.2,22.98 | 131.2,22.98 131.19,22.97 | 131.19,22.97 131.19,15.24 132.09,14.34 J2.3 | R25.1 124.84,27.3 125.6,26.54 131.19,26.54 | 131.19,22.97 131.19,26.54
IO0  (2 unrouted)
  Top 0.254: S2.1 96.65,28.57 TP61.P$1
LED  (1 unrouted)
LIGHT_SENS  (1 unrouted)
  Top 0.254: R27.2 3.84,78.05 LED3.2 TP40.P$1
MOTOR_DIR_A  (2 unrouted)
MOTOR_DIR_B  (2 unrouted)
N$1
  Top 0.254: R6.1 86.18,11.7 77.58,11.7 76.58,12.7 76.58,13.08 | U3.8 77.09,14.17 77.09,13.08 76.58,13.08 | U3.7 76.58,14.17 76.58,13.08
N$3
  Top 0.254: S2.3 100.46,22.86 101.47,23.88 101.47,29.08 100.2,30.35 C1.2
N$4  (23 unrouted)
N$5
  Top 0.254: J16.3 77.3,5.08 77.3,6.66 73.79,10.17 | 73.79,10.17 71.63,12.33 71.63,15.24 72.77,16.38 U3.3 | TP18.P$1 73.79,10.16 73.79,10.17
N$6
  Top 0.254: U3.4 73.79,15.88 72.77,14.86 72.77,13.08 77.99,7.86 J16.2 77.99,3.83 77.85,3.68 73.53,3.68 69.98,7.24 TP17.P$1
N$7
  Top 0.254: R2.1 33.08,85.88 D1.P$1
N$9
  Top 0.254: R3.1 40.31,85.88 D2.P$1
N$10
  Top 0.254: Q1.1 82.13,24.05 81.28,24.89 R4.1
N$11
  Top 0.254: Q2.1 71.82,21.87 R5.1
N$12
  Top 0.254: U3.9 77.6,13.21 78.11,12.7 81.21,12.7 81.92,13.41 R7.1
N$13  (1 unrouted)
N$14  (1 unrouted)
N$15  (1 unrouted)
N$16  (1 unrouted)
N$17  (3 unrouted)
N$18
  Top 0.254: TP54.P$1 67.69,56.52 67.18,56.01 U11.1
N$20  (1 unrouted)
N$21  (1 unrouted)
N$22  (1 unrouted)
N$24
  Top 0.254: U11.14 78.23,53.47 87.72,62.96 BT1.+
N$25  (1 unrouted)
N$26  (2 unrouted)
N$27  (2 unrouted)
N$28  (3 unrouted)
N$29  (3 unrouted)
N$30
  Top 0.254: LED1.4-DIN 99.13,82.68 R22.1 92.07,86.05 U8.3 87.45,85.55 TP49.P$1
N$31  (1 unrouted)
N$32
  Top 0.254: C21.2 7.06,22.62 U9.1
N$33
  Top 0.254: 67.82,71.88 67.82,76.96 71.63,80.77 LS1.N 78.36,82.7 TP42.P$1 | 67.82,71.88 Q4.COLLECTOR | R23.1 71.63,70.87 70.48,72.01 67.94,72.01 67.82,71.88
N$34
  Top 0.254: LED1.2-DOUT 107.86,82.81 LED2.4-DIN
N$35
  Top 0.254: 63.06,70.99 R24.2 64.87,71.25 Q4.BASE
N$36  (1 unrouted)
N$37  (1 unrouted)
N$38  (1 unrouted)
N$39  (1 unrouted)
N$40  (1 unrouted)
N$42  (1 unrouted)
N$43
  Top 0.254: D14.1 5.19,13.87 4.79,13.87 3.43,15.23 3.43,18.98 C21.1
N$44  (1 unrouted)
N$46  (1 unrouted)
N$48  (1 unrouted)
N$50  (1 unrouted)
N$52  (1 unrouted)
NEOPIXELS  (1 unrouted)
  Top 0.254: U8.2 92.52,81.16 R21.1 88.52,79.38 87.38,80.52 TP44.P$1
PWR_INPUT
  Top 0.254: S5.2 46.23,10.29 47.5,11.56 51.94,11.56 54.23,13.84 54.23,15.49 J18.2
PWR_ON
  Top 0.254: 44.2,19.88 R8.1 48.2,19.88 50.29,21.97 TP21.P$1 | 44.2,19.88 43.26,19.88 Q3.1 | 44.2,19.88 43.31,19 43.31,16.79 43.19,16.68 42.89,16.68 D4.2 43.69,16 44.07,15.62 44.07,13.72 42.23,11.88 S5.1
QA  (1 unrouted)
QB  (1 unrouted)
QC  (1 unrouted)
QD  (1 unrouted)
QE  (1 unrouted)
QF  (1 unrouted)
QG  (1 unrouted)
QH  (1 unrouted)
RTS  (1 unrouted)
  Top 0.254: R5.2 76.26,21.89 78.49,21.89 | Q1.2 84.9,22.52 84.26,21.89 78.49,21.89 | 78.49,21.89 78.49,26.67 78.87,27.05 TP63.P$1
RX  (1 unrouted)
RX2  (1 unrouted)
  Top 0.254: TP16.P$1 118.24,11.43 121.03,8.64 J11.2
SHIELD  (5 unrouted)
SHIFTOUT_CLOCK  (2 unrouted)
SHIFTOUT_LATCHCLOCK  (2 unrouted)
SHIFTOUT_SERIALIN  (2 unrouted)
SHIFTOUT_SERIALOUT  (1 unrouted)
SNAP_BUTTON  (1 unrouted)
  Top 0.254: R11.2 8.2,70.18 S4.3 5.33,67.31 5.33,64.9 3.68,63.25 TP41.P$1
SPI_CD
  Top 0.254: J14.P9 134.28,43.22 136.27,45.21 J15.7 R33.2
SPI_MISO  (1 unrouted)
  Top 0.254: J14.P7 130.63,45.42 132.21,46.99 132.21,56.39 131.95,56.64 131.95,59.05 132.59,59.69 133.35,59.69 133.73,60.07 J15.6 R34.2
SPI_MOSI  (1 unrouted)
  Top 0.254: J14.P3 124.11,49.82 124.84,50.55 124.84,52.58 121.92,55.5 121.92,58.8 123.57,60.45 J15.2 R37.1
SPI_SCLK  (1 unrouted)
  Top 0.254: J14.P5 126.36,47.62 128.65,49.91 J15.4 R35.2
SPI_SS  (1 unrouted)
  Top 0.254: J14.P2 120.53,50.92 119.13,52.32 119.13,58.55 121.03,60.45 J15.1 120.78,63.25 R36.1
TEMP_SENS  (1 unrouted)
  Top 0.254: TP39.P$1 12.7,78.99 11.43,78.99 10.29,77.85 10.29,76.2 10.81,75.68 X1.3
TX  (1 unrouted)
TX2  (1 unrouted)
  Top 0.254: J11.1 116.84,8.3 TP15.P$1
V_BATT  (11 unrouted)
  Top 0.254: Q3.3 39.88,22.01 39.88,26.42 42.55,29.08 TP22.P$1
V_USB  (via drill 0.25)  (6 unrouted)
  Top 0.254: J16.1 78.64,6.89 v79.5,7.75 88.01,7.75 89.86,9.6 R6.2 | J1.4 108.08,7.29 112.35,11.56 TP12.P$1
  Bottom 0.254: J18.3 64.52,7.75 v79.5,7.75
VCC  (via drill 0.25)  (6 unrouted)
  Top 0.254: U3.5 74.31,15.38 74.3,15.37 74.3,14.86 | U3.6 74.31,14.88 74.3,14.86 | R7.2 v78.23,9.71 78.05,9.71 74.3,13.46 74.3,14.86 | 10.41,45.34 U2.2 10.41,49.15 9.65,49.91 5.71,49.91 5.08,49.28 TP27.P$1 | 10.41,45.34 10.41,43.62 C2.1 | X1.4 16.45,75.68 C20.2 17.53,73.41 16.76,72.64 16,72.64 | 16,72.64 3.94,72.64 2.67,73.91 LED3.1 | S4.1 10.29,68.45 15.24,68.45 16,69.22 | 16,69.22 16,72.64 | C18.2 71.25,44.07 | 71.25,44.07 C19.2 | 71.25,44.07 71.25,52.58 69.09,54.74 U11.2 v63.88,54.74 | U8.1 91.71,84.45 93.34,84.45 93.98,83.82 93.98,81.92 | R21.2 93.98,79.83 93.98,81.92 | 120.65,70.68 R36.2 120.78,72.52 v121.41,73.15 123.57,73.15 | R25.2 124.84,35.05 125.6,35.81 v126.75,35.81 128.02,35.81 128.65,35.18 R26.2 | J14.P4 124.79,48.72 126.62,50.55 126.62,62.48 J15.3 126.11,73.03 125.98,73.15 | 123.57,73.15 125.98,73.15 | 125.98,73.15 128.65,73.15 | 128.65,73.15 133.73,73.15 | 133.73,73.15 135.51,73.15 136.27,72.39 R33.1 | R37.2 123.57,73.15 | R35.1 128.65,73.15 | R34.1 133.73,73.15 | U1.2 v26.8,63.93 16.56,63.93 | 16,69.22 16.56,68.65 16.56,63.93 | 16.56,63.93 16.56,47.04 14.99,45.47 v14.99,45.34 | v11.43,45.34 10.41,45.34 | v93.22,81.92 93.98,81.92 | R1.2 v114.68,30.35 | J2.2 v134.37,13.34 | J4.2 134.36,21.98 v134.37,21.97 | J5.2 v134.37,30.86
  Bottom 0.254: v14.99,45.34 v11.43,45.34 | v26.8,63.93 26.8,74.55 29.08,76.83 52.07,76.83 57.28,71.63 57.28,66.93 | 57.28,66.93 57.28,54.99 57.53,54.74 60.96,54.74 | 60.96,54.74 v63.88,54.74 | 93.22,66.93 v93.22,81.92 | 60.96,54.74 60.96,20.45 71.75,9.65 78.23,9.65 v78.23,9.71 78.29,9.65 114.94,9.65 | 93.22,66.93 113.03,66.93 119.25,73.15 v121.41,73.15 | v126.75,35.81 132.21,35.81 134.37,33.66 v134.37,30.86 v134.37,21.97 v134.37,13.34 128.27,7.24 114.94,7.24 114.94,9.65 | v114.68,30.35 114.94,30.1 114.94,9.65 | 57.28,66.93 93.22,66.93
VIN  (4 unrouted)
  Top 0.254: D4.1 37.21,16 35.81,17.4 35.81,18.29 36.83,19.3 40.64,19.3 41.78,20.45 41.78,21.08 42.86,22.16 Q3.2 45.73,22.16 C4.2 47.93,22.53 49.66,24.26 TP23.P$1 | C3.1 12.88,47.05 U2.3 12.71,50.41 12.19,50.93 8.51,50.93 8,51.44 TP26.P$1

## Text on the board
tNames: Light Sensor | Temperature Sensor | Buzzer | Microcontroller | Neopixels | RTC | Button | Micro SD | 3.3V Regulator | 5V Regulator | Qwiic Headers | Power Input | Programmer | Motor Driver | High Brightness LEDs | Hall Effect Sensors | Shift Out Register | Charger | Boost A or B | Boost Circuit A | Boost Circuit B | Batt. Level Selector | Power Input Test Points | LiPo Battery / Voltage Divider | Boost Test Points